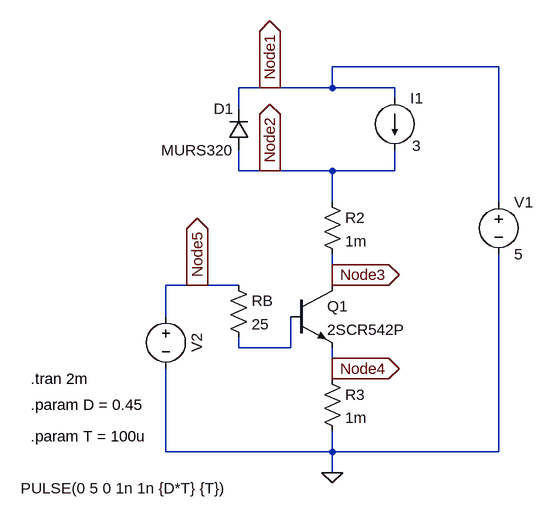
[diagram p0: schematic POE_2025_w9_BJT_v1_RB1.asc]
POE_2025_w9_BJT_v1_RB1.asc, the LTspice schematic file:
Version 4
SHEET 1 880 680
WIRE 816 -144 560 -144
WIRE 464 -112 416 -112
WIRE 560 -112 560 -144
WIRE 560 -112 464 -112
WIRE 656 -112 560 -112
WIRE 656 -96 656 -112
WIRE 416 -80 416 -112
WIRE 416 16 416 -16
WIRE 464 16 416 16
WIRE 560 16 464 16
WIRE 656 16 656 -16
WIRE 656 16 560 16
WIRE 560 64 560 16
WIRE 816 64 816 -144
WIRE 560 176 560 144
WIRE 352 192 304 192
WIRE 416 192 352 192
WIRE 560 192 560 176
WIRE 304 240 304 192
WIRE 416 288 416 272
WIRE 496 288 496 240
WIRE 496 288 416 288
WIRE 560 320 560 288
WIRE 560 336 560 320
WIRE 304 448 304 320
WIRE 560 448 560 416
WIRE 560 448 304 448
WIRE 816 448 816 144
WIRE 816 448 560 448
WIRE 560 480 560 448
FLAG 560 480 0
FLAG 464 -112 Node1
IOPIN 464 -112 Out
FLAG 464 16 Node2
IOPIN 464 16 Out
FLAG 560 176 Node3
IOPIN 560 176 Out
FLAG 560 320 Node4
IOPIN 560 320 Out
FLAG 352 192 Node5
IOPIN 352 192 Out
SYMBOL voltage 304 224 R0
WINDOW 0 32 56 VTop 2
WINDOW 3 -64 296 Bottom 2
WINDOW 123 0 0 Left 2
WINDOW 39 0 0 Left 2
SYMATTR InstName V2
SYMATTR Value PULSE(0 5 0 1n 1n {D*T} {T})
SYMBOL current 656 -96 R0
WINDOW 3 27 73 Left 2
WINDOW 123 0 0 Left 2
WINDOW 39 0 0 Left 2
SYMATTR Value 3
SYMATTR InstName I1
SYMBOL voltage 816 48 R0
SYMATTR InstName V1
SYMATTR Value 5
SYMBOL res 544 48 R0
SYMATTR InstName R2
SYMATTR Value 1m
SYMBOL res 544 320 R0
SYMATTR InstName R3
SYMATTR Value 1m
SYMBOL diode 432 -16 R180
WINDOW 0 24 64 Left 2
WINDOW 3 24 0 Left 2
SYMATTR InstName D1
SYMATTR Value MURS320
SYMBOL res 400 176 R0
SYMATTR InstName RB
SYMATTR Value 25
SYMBOL npn 496 192 R0
SYMATTR InstName Q1
SYMATTR Value 2SCR542P
TEXT 96 376 Left 2 !.param D = 0.45
TEXT 96 424 Left 2 !.param T = 100u
TEXT 96 336 Left 2 !.tran 2m

The netlist it stands for:
* POE_2025_w9_BJT_v1_RB1.asc
V2 Node5 0 PULSE(0 5 0 1n 1n {D*T} {T})
I1 Node1 Node2 3
V1 Node1 0 5
R2 Node2 Node3 1m
R3 Node4 0 1m
D1 Node2 Node1 MURS320
RB Node5 N001 25
Q1 Node3 N001 Node4 0 2SCR542P
.model D D
.lib standard.dio
.model NPN NPN
.model PNP PNP
.lib standard.bjt
.param D = 0.45
.param T = 100u
.tran 2m
.backanno
.end